# Altium schematic sheet MB_main.SchDoc
size A1; PageSetup: Record=PageOptions|CenterHorizontal=True|CenterVertical=True|PrintScale=1.00|XCorrection=1.00|YCorrection=1.00|PrintKind=0|BorderSize=5000000|LeftOffset=0|BottomOffset=0|Orientation=2|PaperLength=1000|PaperWidth=1000|Scale=100|PaperSource=7|PrintQuality=-4|MediaType=1|DitherType=10|PaperKind=Custom Size|PrintScaleMode=0
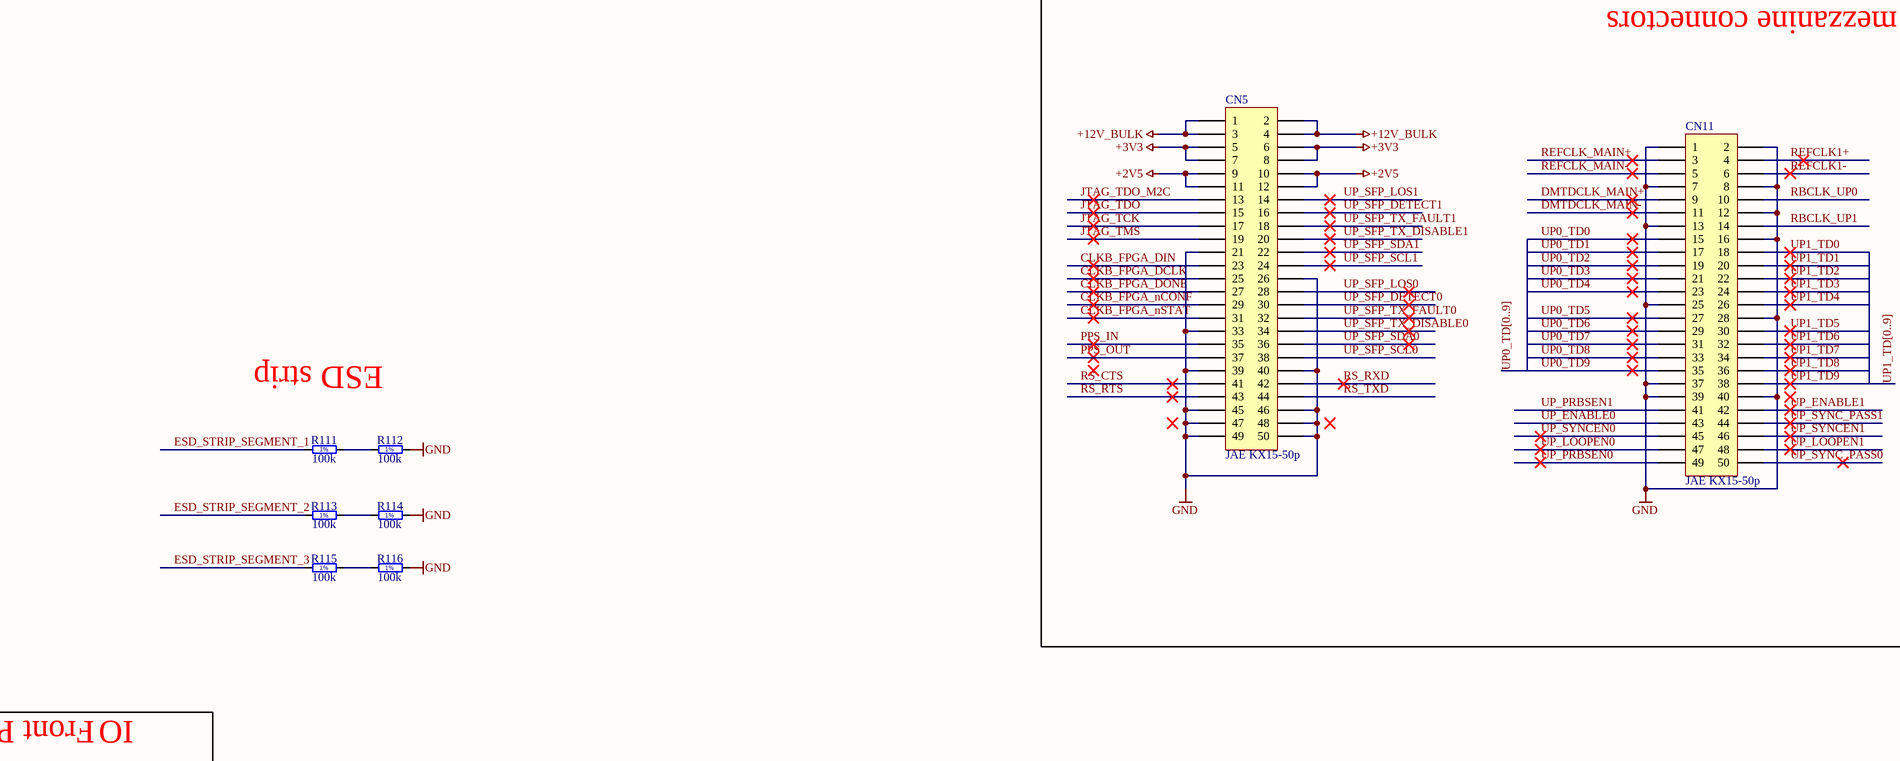
[diagram p0: MB_main.SchDoc, top left]
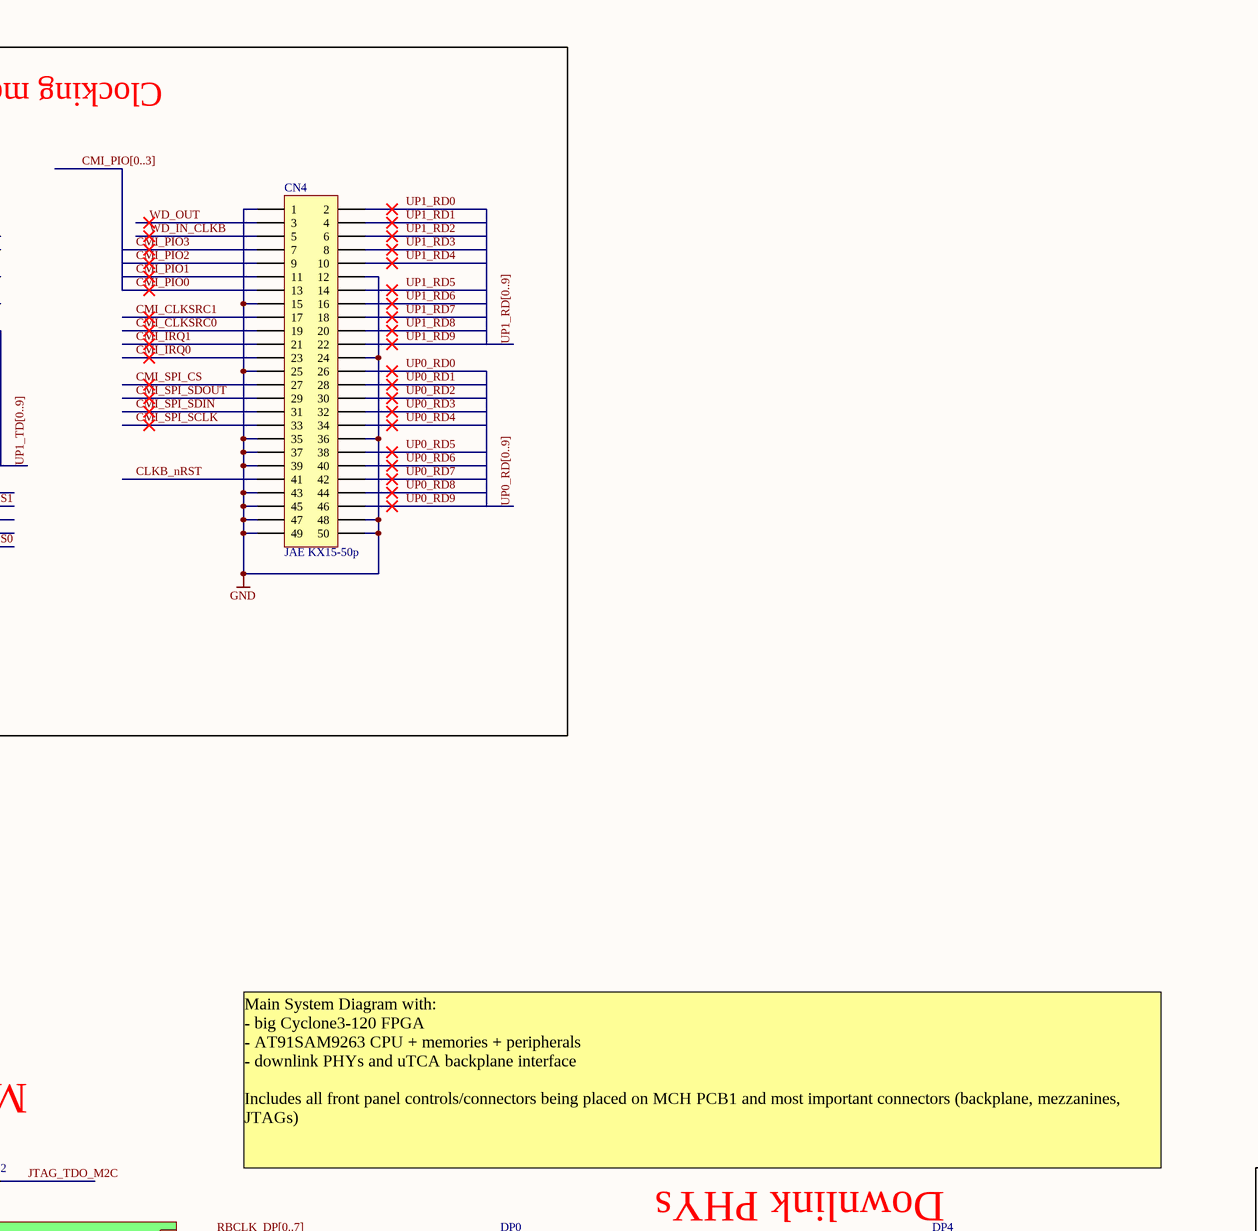
[diagram p1: MB_main.SchDoc, top right]
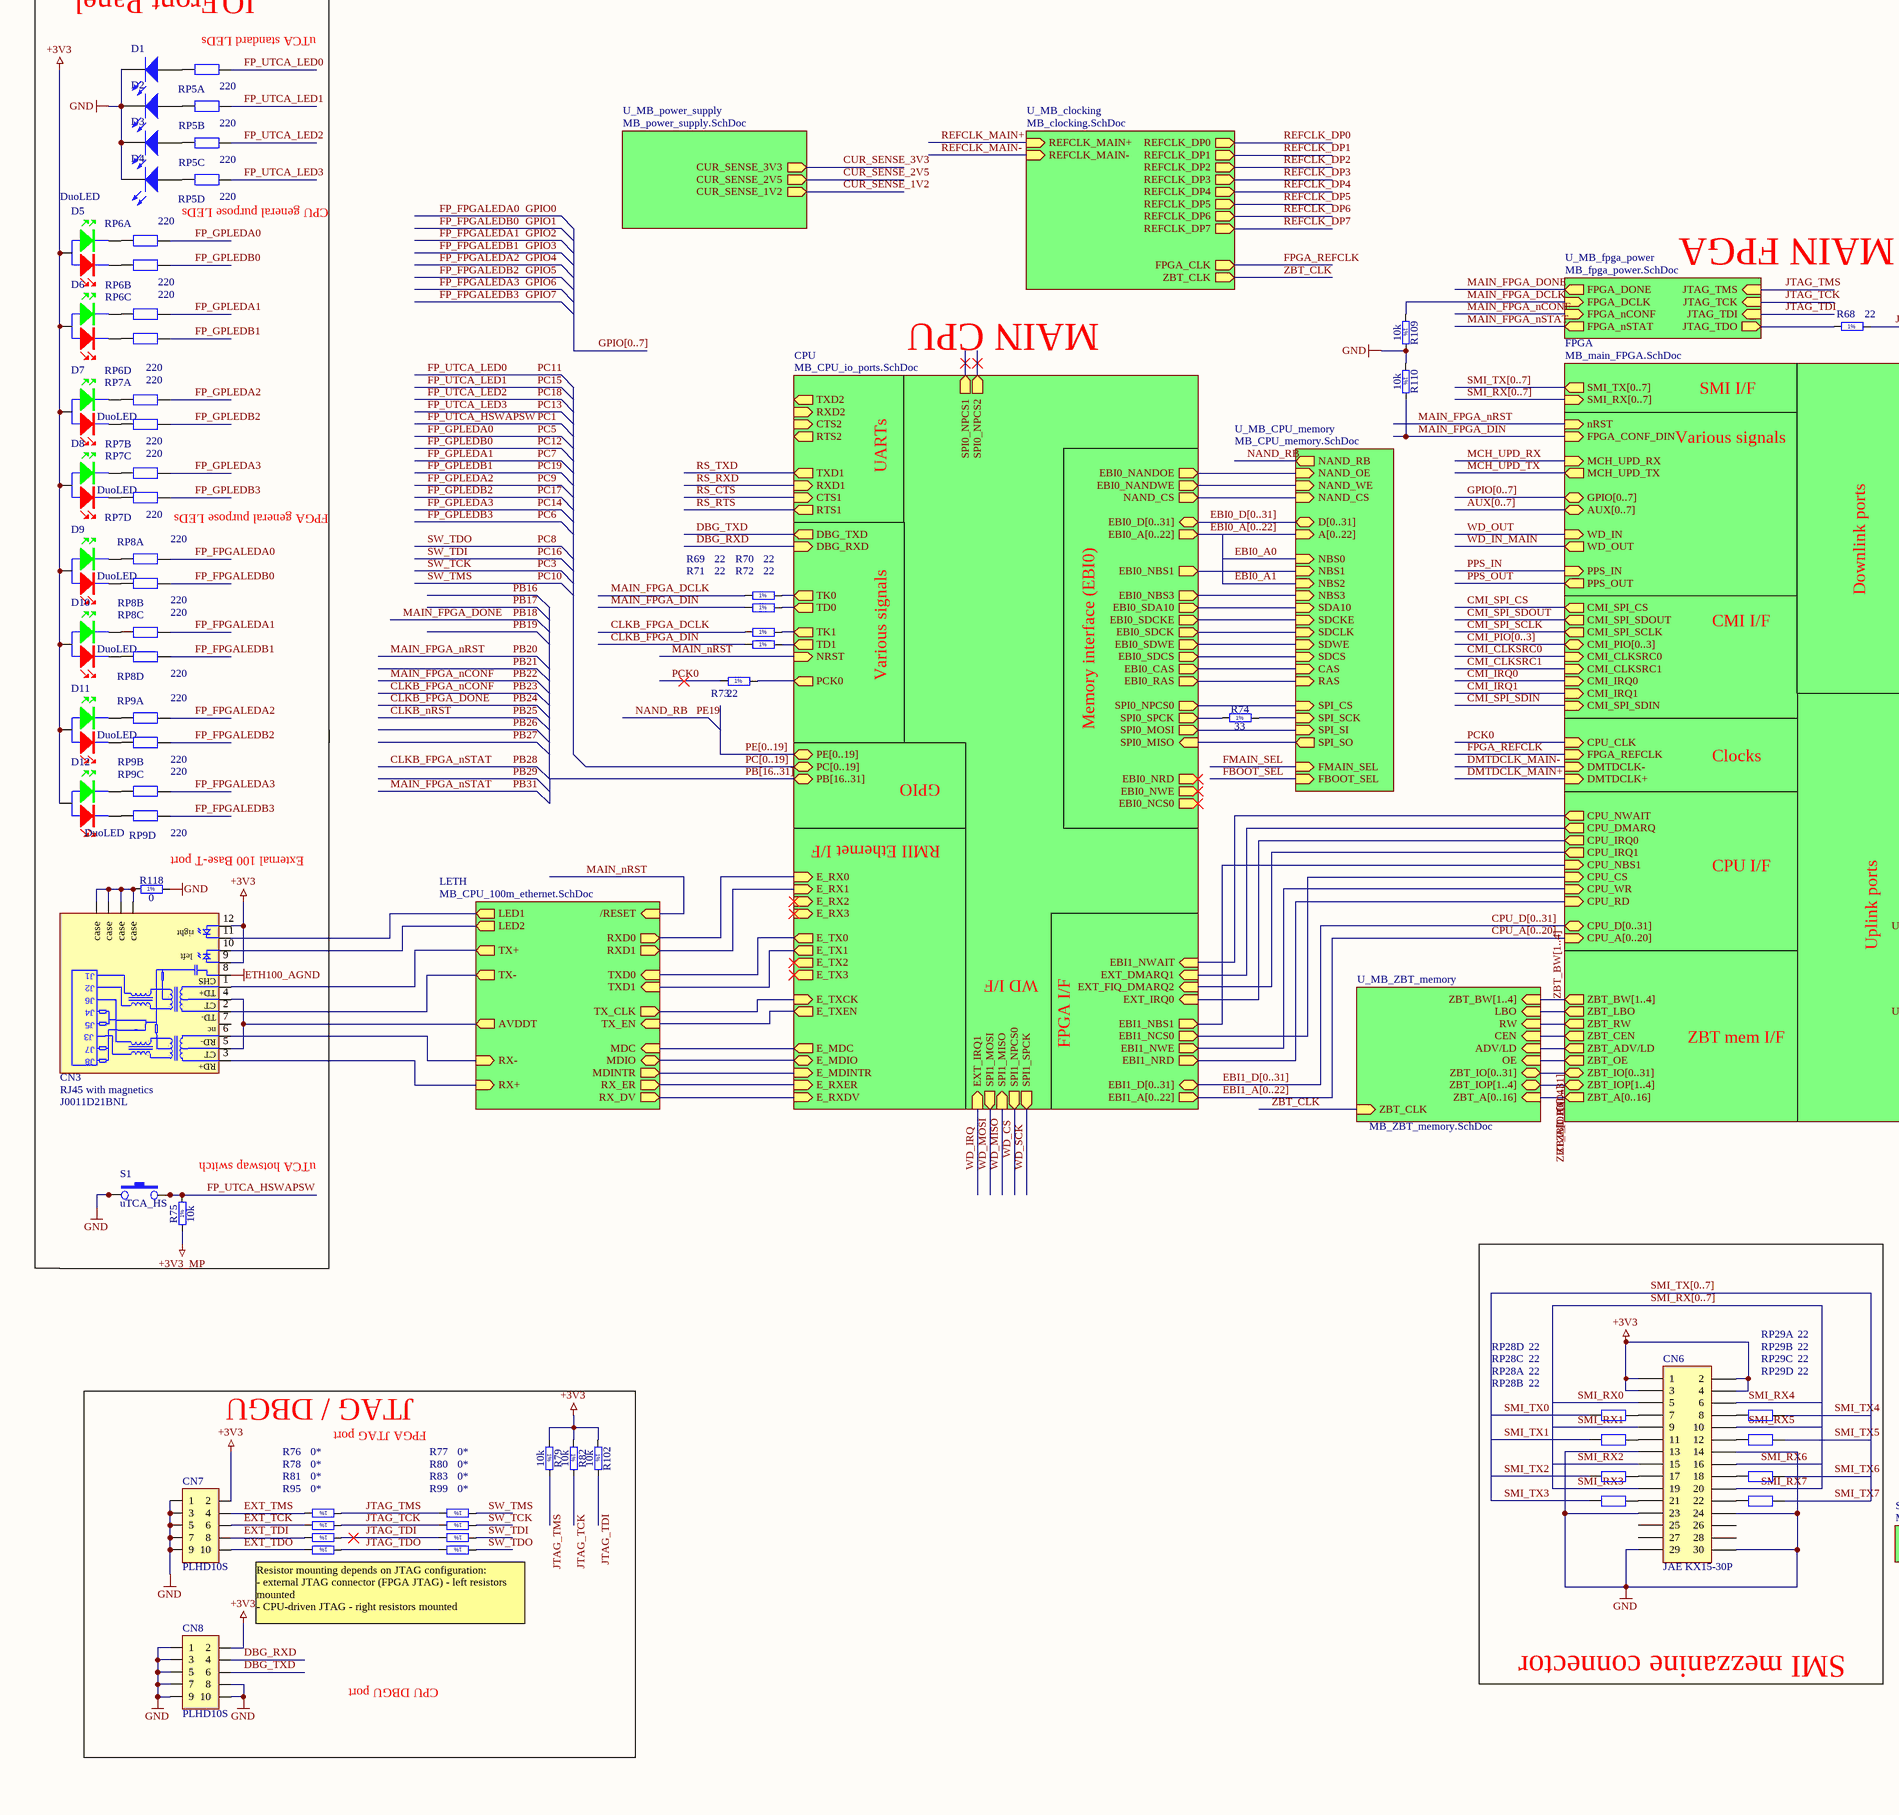
[diagram p2: MB_main.SchDoc, bottom left]
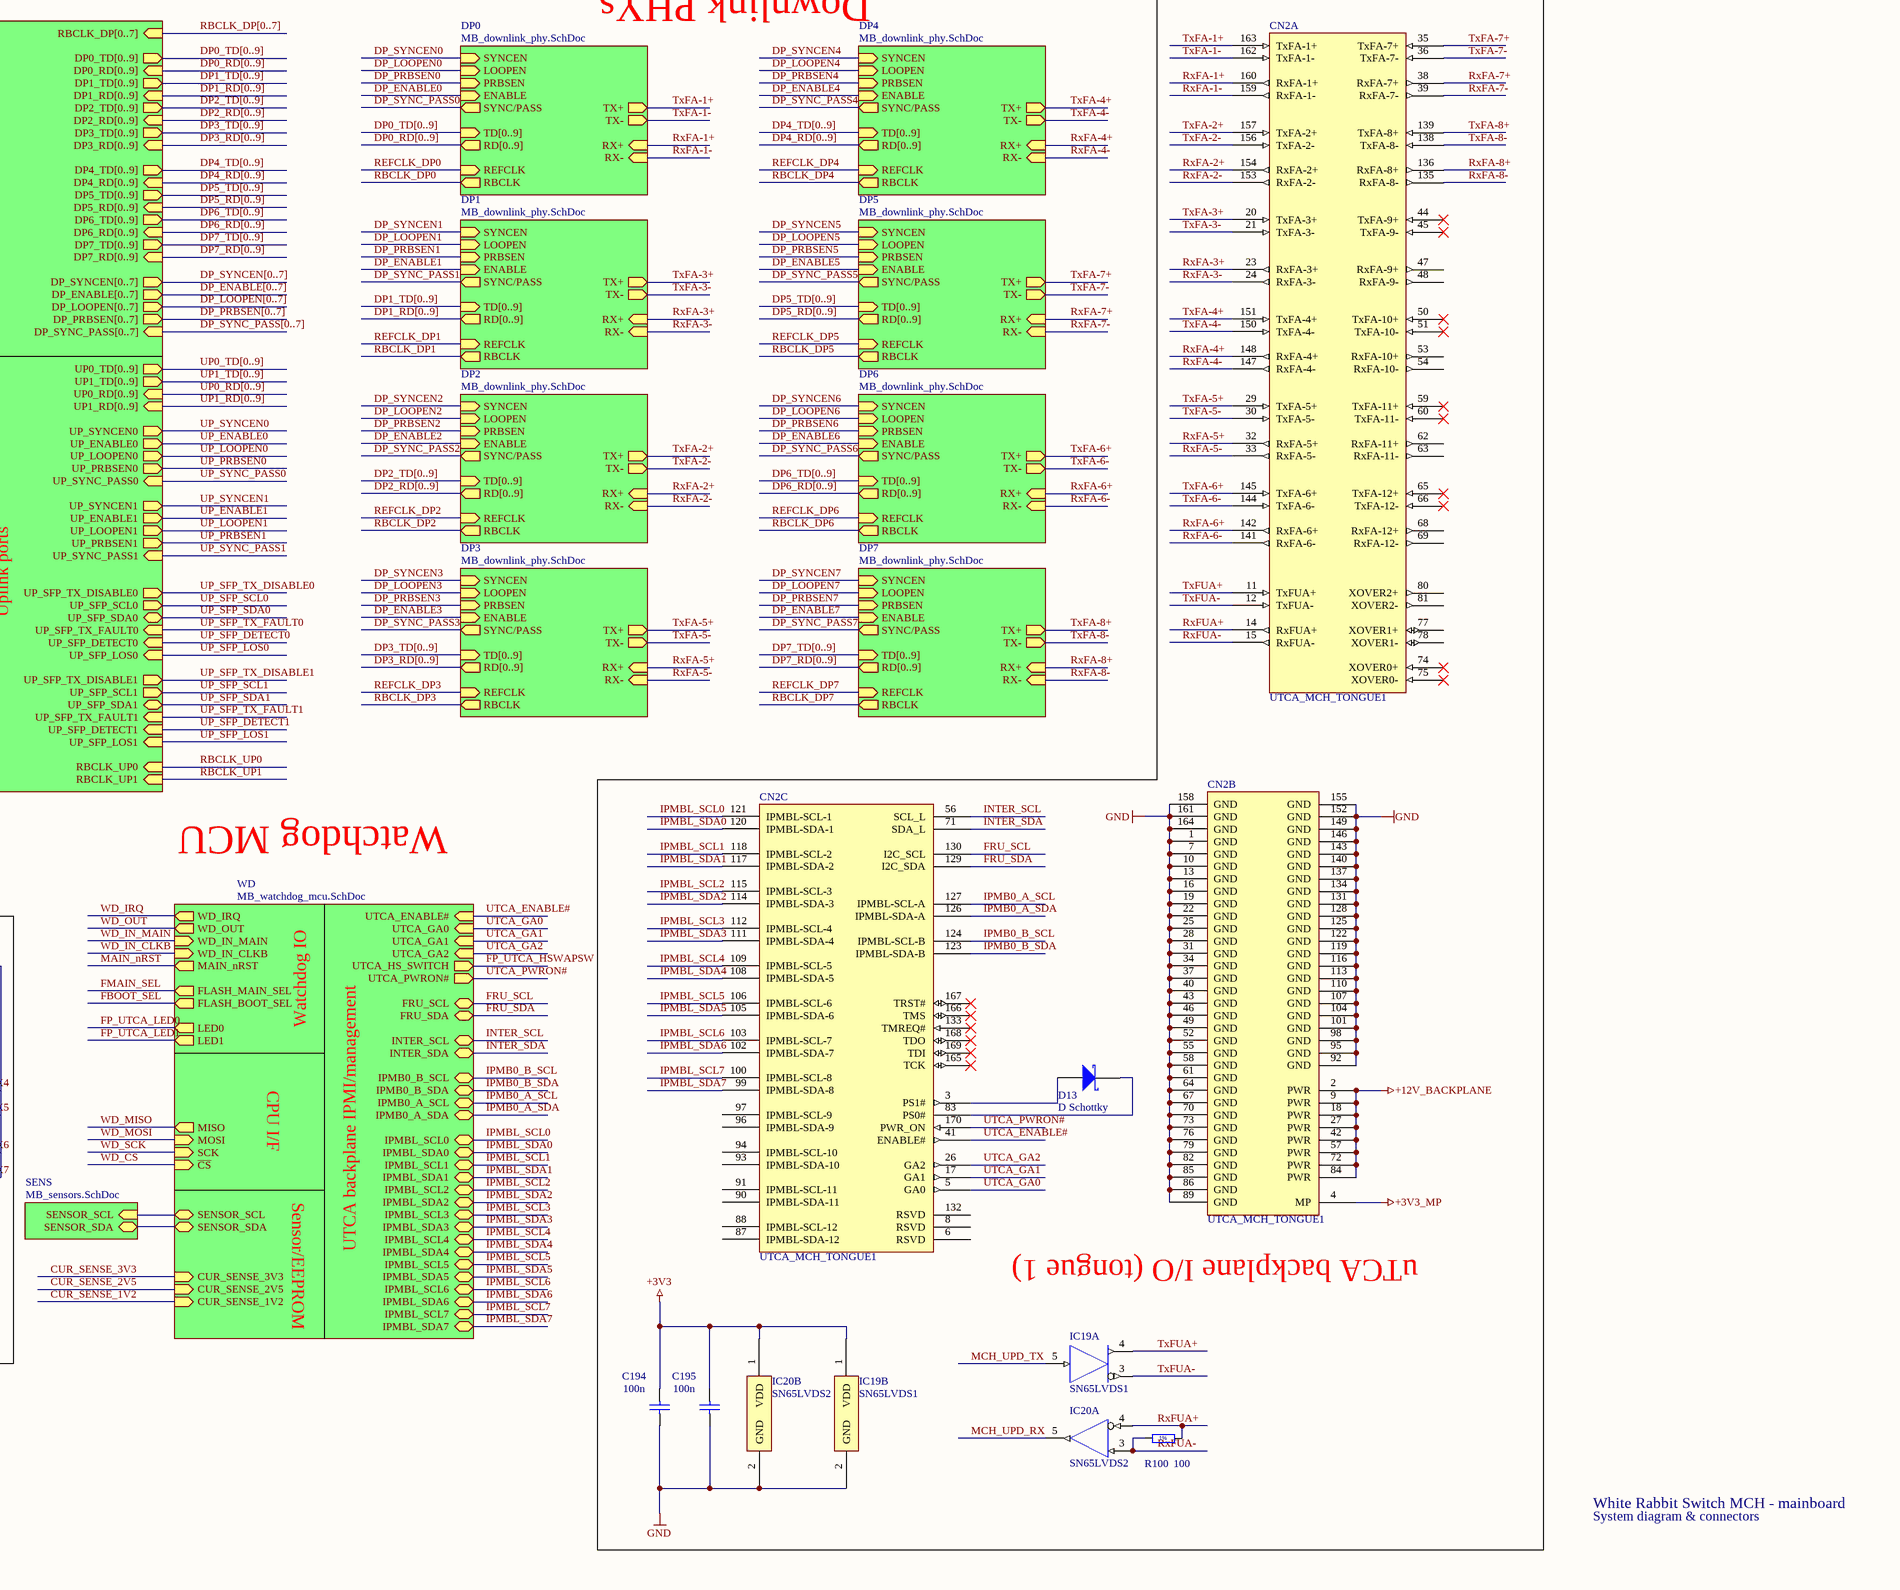
[diagram p3: MB_main.SchDoc, bottom right]

## Parts
C194  100n  [CAPC1005X55N]
C195  100n  [CAPC1005X55N]
CN2  UTCA_MCH_TONGUE1  (parts A,B,C of 3)
CN3  RJ45 with magnetics  value J0011D21BNL  [J0011D21BNL]
CN4  JAE KX15-50p  [JAE_KX15_50P]
CN5  JAE KX15-50p  [JAE_KX15_50P]
CN6  JAE KX15-30P  [JAE_KX15_30P]
CN7  PLHD10S  [PLHTD10S-GC]
CN8  PLHD10S  [PLHTD10S-GC]
CN11  JAE KX15-50p  [JAE_KX15_50P]
D1  LED  [CD1608-0603]  (value not drawn)
D2  LED  [CD1608-0603]  (value not drawn)
D3  LED  [CD1608-0603]  (value not drawn)
D4  LED  [CD1608-0603]  (value not drawn)
D5  DuoLED  [DUOLED_LNJ123]  (value not drawn)
D6  DuoLED  [DUOLED_LNJ123]
D7  DuoLED  [DUOLED_LNJ123]
D8  DuoLED  [DUOLED_LNJ123]
D9  DuoLED  [DUOLED_LNJ123]
D10  DuoLED  [DUOLED_LNJ123]
D11  DuoLED  [DUOLED_LNJ123]
D12  DuoLED  [DUOLED_LNJ123]
D13  D Schottky  [CD2012-0805]
IC19  SN65LVDS1  [SOT23-5AL]  (parts A,B of 2)
IC20  SN65LVDS2  [SOT23-5AL]  (parts A,B of 2)
R68  22  [RESC1005X40N]
R69  22  [RESC1005X40N]
R70  22  [RESC1005X40N]
R71  22  [RESC1005X40N]
R72  22  [RESC1005X40N]
R73  22  [RESC1005X40N]
R74  33  [RESC1005X40N]
R75  10k  [RESC1005X40N]
R76  0*  [RESC1005X40N]
R77  0*  [RESC1005X40N]
R78  0*  [RESC1005X40N]
R79  10k  [RESC1005X40N]
R80  0*  [RESC1005X40N]
R81  0*  [RESC1005X40N]
R82  10k  [RESC1005X40N]
R83  0*  [RESC1005X40N]
R95  0*  [RESC1005X40N]
R99  0*  [RESC1005X40N]
R100  100  [RESC1005X40N]
R102  10k  [RESC1005X40N]
R109  10k  [RESC1005X40N]
R110  10k  [RESC1005X40N]
R111  100k  [RESC3216X65N]
R112  100k  [RESC3216X65N]
R113  100k  [RESC3216X65N]
R114  100k  [RESC3216X65N]
R115  100k  [RESC3216X65N]
R116  100k  [RESC3216X65N]
R118  0  [RESC3216X65N]
RP5  value 220  [YC124]  (hidden comment: RES_PACK)  (parts A,B,C,D of 4)
RP6  value 220  [YC124]  (hidden comment: RES_PACK)  (parts A,B,C,D of 4)
RP7  value 220  [YC124]  (hidden comment: RES_PACK)  (parts A,B,C,D of 4)
RP8  value 220  [YC124]  (hidden comment: RES_PACK)  (parts A,B,C,D of 4)
RP9  value 220  [YC124]  (hidden comment: RES_PACK)  (parts A,B,C,D of 4)
RP28  value 22  [YC124]  (hidden comment: RES_PACK)  (parts A,B,C,D of 4)
RP29  value 22  [YC124]  (hidden comment: RES_PACK)  (parts A,B,C,D of 4)
S1  uTCA_HS  [uTCA_HOTSWAP_SWITCH]

## Blocks framed on the sheet
Clocking mezzanine connectors: CN4 CN5 CN11
uTCA backplane I/O (tongue 1): C194 C195 CN2 D13 IC19 IC20 R100
SMI mezzanine connector: CN6 RP28 RP29
JTAG / DBGU: CN7 CN8 R76-R83 R95 R99 R102

## Sub-sheets
CPU = MB_CPU_io_ports.SchDoc: EXT_IRQ0 (in), EXT_IRQ1 (in), EXT_DMARQ1 (in), EXT_FIQ_DMARQ2 (in), TXD1 (out), RXD1 (in), TXD2 (out), RXD2 (in), RTS2 (out), CTS2 (in), RTS1 (out), CTS1 (in), DBG_TXD (out), DBG_RXD (in), E_TX2 (out), E_TX3 (out), E_RX2 (in), E_RX3 (in), EBI1_NWAIT (in), E_RXER (in), E_TXEN (out), E_MDC (out), E_MDIO (bidir), E_MDINTR (in), E_RXDV (in), EBI0_NWE (out), EBI0_NRD (out), EBI0_NBS1 (out), EBI0_NBS3 (out), EBI0_SDCS (out), EBI0_SDCK (out), EBI0_SDCKE (out), EBI0_SDA10 (out), EBI0_SDWE (out), EBI0_CAS (out), EBI0_RAS (out), EBI1_NCS0 (out), EBI1_NRD (out), EBI1_NWE (out), EBI1_NBS1 (out), PB[16..31] (bidir), PE[0..19] (bidir), PC[0..19] (bidir), EBI0_D[0..31] (bidir), EBI1_D[0..31] (bidir), EBI0_A[0..22] (out), EBI1_A[0..22] (out), NAND_CS (out), EBI0_NCS0 (out), EBI0_NANDOE (out), EBI0_NANDWE (out), E_TX0 (out), E_TX1 (out), E_RX0 (in), E_RX1 (in), SPI0_SPCK (out), SPI0_NPCS1 (out), SPI0_NPCS2 (out), SPI0_NPCS0 (out), SPI1_SPCK (out), SPI1_NPCS0 (out), TK0 (out), TD0 (out), TK1 (out), TD1 (out), SPI0_MISO (in), SPI0_MOSI (out), SPI1_MISO (in), SPI1_MOSI (out), PCK0 (out), E_TXCK (in), NRST (in)
DP0 = MB_downlink_phy.SchDoc: SYNCEN (in), LOOPEN (in), PRBSEN (in), ENABLE (in), SYNC/PASS (out), TD[0..9] (in), RD[0..9] (out), RBCLK (out), REFCLK (in), TX+ (out), TX- (out), RX+ (in), RX- (in)
DP1 = MB_downlink_phy.SchDoc: SYNCEN (in), LOOPEN (in), PRBSEN (in), ENABLE (in), SYNC/PASS (out), TD[0..9] (in), RD[0..9] (out), RBCLK (out), REFCLK (in), TX+ (out), TX- (out), RX+ (in), RX- (in)
DP2 = MB_downlink_phy.SchDoc: SYNCEN (in), LOOPEN (in), PRBSEN (in), ENABLE (in), SYNC/PASS (out), TD[0..9] (in), RD[0..9] (out), RBCLK (out), REFCLK (in), TX+ (out), TX- (out), RX+ (in), RX- (in)
DP3 = MB_downlink_phy.SchDoc: SYNCEN (in), LOOPEN (in), PRBSEN (in), ENABLE (in), SYNC/PASS (out), TD[0..9] (in), RD[0..9] (out), RBCLK (out), REFCLK (in), TX+ (out), TX- (out), RX+ (in), RX- (in)
DP4 = MB_downlink_phy.SchDoc: SYNCEN (in), LOOPEN (in), PRBSEN (in), ENABLE (in), SYNC/PASS (out), TD[0..9] (in), RD[0..9] (out), RBCLK (out), REFCLK (in), TX+ (out), TX- (out), RX+ (in), RX- (in)
DP5 = MB_downlink_phy.SchDoc: SYNCEN (in), LOOPEN (in), PRBSEN (in), ENABLE (in), SYNC/PASS (out), TD[0..9] (in), RD[0..9] (out), RBCLK (out), REFCLK (in), TX+ (out), TX- (out), RX+ (in), RX- (in)
DP6 = MB_downlink_phy.SchDoc: SYNCEN (in), LOOPEN (in), PRBSEN (in), ENABLE (in), SYNC/PASS (out), TD[0..9] (in), RD[0..9] (out), RBCLK (out), REFCLK (in), TX+ (out), TX- (out), RX+ (in), RX- (in)
DP7 = MB_downlink_phy.SchDoc: SYNCEN (in), LOOPEN (in), PRBSEN (in), ENABLE (in), SYNC/PASS (out), TD[0..9] (in), RD[0..9] (out), RBCLK (out), REFCLK (in), TX+ (out), TX- (out), RX+ (in), RX- (in)
FPGA = MB_main_FPGA.SchDoc: FPGA_CONF_DIN (in), DP0_TD[0..9] (out), DP0_RD[0..9] (in), DP1_TD[0..9] (out), DP1_RD[0..9] (in), DP2_TD[0..9] (out), DP2_RD[0..9] (in), DP3_TD[0..9] (out), DP3_RD[0..9] (in), DP4_TD[0..9] (out), DP4_RD[0..9] (in), DP5_TD[0..9] (out), DP5_RD[0..9] (in), DP6_TD[0..9] (out), DP6_RD[0..9] (in), DP7_TD[0..9] (out), DP7_RD[0..9] (in), UP0_TD[0..9] (out), UP0_RD[0..9] (in), UP1_TD[0..9] (out), UP1_RD[0..9] (in), DP_PRBSEN[0..7] (out), DP_SYNCEN[0..7] (out), DP_ENABLE[0..7] (out), DP_LOOPEN[0..7] (out), DP_SYNC_PASS[0..7] (in), UP_PRBSEN0 (out), UP_LOOPEN0 (out), UP_SYNCEN0 (out), UP_ENABLE0 (out), UP_SYNC_PASS0 (in), UP_PRBSEN1 (out), UP_LOOPEN1 (out), UP_SYNCEN1 (out), UP_ENABLE1 (out), UP_SYNC_PASS1 (in), UP_SFP_TX_FAULT0 (in), UP_SFP_TX_DISABLE0 (out), UP_SFP_SDA0 (bidir), UP_SFP_SCL0 (out), UP_SFP_DETECT0 (in), UP_SFP_LOS0 (in), UP_SFP_TX_FAULT1 (in), UP_SFP_TX_DISABLE1 (out), UP_SFP_SDA1 (bidir), UP_SFP_SCL1 (out), UP_SFP_DETECT1 (in), UP_SFP_LOS1 (in), ZBT_LBO (out), ZBT_RW (out), ZBT_CEN (out), ZBT_ADV/LD (out), ZBT_OE (out), ZBT_IO[0..31] (bidir), ZBT_IOP[1..4] (bidir), ZBT_A[0..16] (out), ZBT_BW[1..4] (out), GPIO[0..7] (bidir), DMTDCLK+ (in), DMTDCLK- (in), FPGA_REFCLK (in), WD_IN (in), WD_OUT (out), PPS_IN (in), PPS_OUT (out), MCH_UPD_TX (out), MCH_UPD_RX (in), SMI_TX[0..7] (out), SMI_RX[0..7] (in), CPU_D[0..31] (bidir), CPU_CLK (in), AUX[0..7] (bidir), CMI_PIO[0..3] (bidir), CPU_WR (in), CPU_RD (in), CPU_CS (in), CPU_NWAIT (out), CPU_DMARQ (out), CPU_IRQ0 (out), CPU_IRQ1 (out), CMI_CLKSRC0 (in), CMI_CLKSRC1 (in), CMI_IRQ0 (in), CMI_IRQ1 (in), CMI_SPI_CS (out), CMI_SPI_SDOUT (out), CMI_SPI_SDIN (in), CMI_SPI_SCLK (out), RBCLK_DP[0..7] (in), RBCLK_UP0 (in), RBCLK_UP1 (in), nRST (in), CPU_A[0..20] (in), CPU_NBS1 (in)
LETH = MB_CPU_100m_ethernet.SchDoc: TXD0 (in), TXD1 (in), TX_EN (in), RXD1 (out), RXD0 (out), RX_DV (out), RX_ER (out), MDC (in), MDIO (bidir), MDINTR (out), RX+ (in), RX- (in), LED1 (out), LED2 (out), TX+ (out), TX- (out), AVDDT (out), TX_CLK (out), /RESET (in)
SENS = MB_sensors.SchDoc: SENSOR_SDA (bidir), SENSOR_SCL (in)
U_MB_clocking = MB_clocking.SchDoc: REFCLK_MAIN+ (in), REFCLK_MAIN- (in), REFCLK_DP0 (out), REFCLK_DP1 (out), REFCLK_DP2 (out), REFCLK_DP3 (out), REFCLK_DP4 (out), REFCLK_DP5 (out), REFCLK_DP6 (out), REFCLK_DP7 (out), FPGA_CLK (out), ZBT_CLK (out)
U_MB_CPU_memory = MB_CPU_memory.SchDoc: NBS0 (in), NBS1 (in), NBS2 (in), NBS3 (in), A[0..22] (in), CAS (in), RAS (in), NAND_OE (in), NAND_WE (in), NAND_CS (in), NAND_RB (out), FMAIN_SEL (in), FBOOT_SEL (in), SPI_CS (in), SPI_SCK (in), SPI_SI (in), SPI_SO (out), SDA10 (in), D[0..31] (bidir), SDCS (in), SDCKE (in), SDCLK (in), SDWE (in)
U_MB_fpga_power = MB_fpga_power.SchDoc: JTAG_TDI (in), JTAG_TDO (out), JTAG_TMS (in), JTAG_TCK (in), FPGA_DCLK (in), FPGA_DONE (out), FPGA_nCONF (in), FPGA_nSTAT (out)
U_MB_power_supply = MB_power_supply.SchDoc: CUR_SENSE_3V3 (out), CUR_SENSE_2V5 (out), CUR_SENSE_1V2 (out)
U_MB_ZBT_memory = MB_ZBT_memory.SchDoc: LBO (in), RW (in), CEN (in), ADV/LD (in), OE (in), ZBT_IOP[1..4] (bidir), ZBT_IO[0..31] (bidir), ZBT_A[0..16] (in), ZBT_BW[1..4] (in), ZBT_CLK (in)
WD = MB_watchdog_mcu.SchDoc: MAIN_nRST (out), UTCA_GA0 (in), UTCA_GA1 (in), UTCA_GA2 (in), UTCA_ENABLE# (in), WD_IN_MAIN (in), WD_IN_CLKB (in), WD_OUT (out), FLASH_MAIN_SEL (out), FLASH_BOOT_SEL (out), UTCA_PWRON# (out), WD_IRQ (out), IPMB0_A_SDA (bidir), IPMB0_A_SCL (bidir), IPMB0_B_SCL (bidir), IPMB0_B_SDA (bidir), FRU_SCL (bidir), FRU_SDA (bidir), INTER_SCL (bidir), INTER_SDA (bidir), SENSOR_SCL (bidir), SENSOR_SDA (bidir), MOSI (in), SCK (in), MISO (out), ~{CS} (in), IPMBL_SCL0 (bidir), IPMBL_SCL1 (bidir), IPMBL_SCL2 (bidir), IPMBL_SCL3 (bidir), IPMBL_SCL4 (bidir), IPMBL_SCL5 (bidir), IPMBL_SCL6 (bidir), IPMBL_SCL7 (bidir), IPMBL_SDA0 (bidir), IPMBL_SDA1 (bidir), IPMBL_SDA2 (bidir), IPMBL_SDA3 (bidir), IPMBL_SDA4 (bidir), IPMBL_SDA5 (bidir), IPMBL_SDA6 (bidir), IPMBL_SDA7 (bidir), UTCA_HS_SWITCH (out), CUR_SENSE_1V2 (in), CUR_SENSE_2V5 (in), CUR_SENSE_3V3 (in), LED0 (out), LED1 (out)

## Nets
+2V5: CN5.9 CN5.10 CN5.11 CN5.12
+3V3: C194.2 C195.2 CN3.9 CN3.12 CN5.5 CN5.6 CN5.7 CN5.8 CN6.1 CN6.2 CN6.3 CN6.4 CN7.2 CN8.2 D5.A D6.A D7.A D8.A D9.A D10.A D11.A D12.A IC19.1(VDD) IC20.1(VDD) R79.1 R82.1 R102.1
+3V3_MP: CN2.4(MP) R75.1
+12V_BACKPLANE: CN2.2(PWR) CN2.9(PWR) CN2.18(PWR) CN2.27(PWR) CN2.42(PWR) CN2.57(PWR) CN2.72(PWR) CN2.84(PWR)
+12V_BULK: CN5.1 CN5.2 CN5.3 CN5.4
ETH100_AGND: CN3.8
GND: C194.1 C195.1 CN2.1(GND) CN2.7(GND) CN2.10(GND) CN2.13(GND) CN2.16(GND) CN2.19(GND) CN2.22(GND) CN2.25(GND) CN2.28(GND) CN2.31(GND) CN2.34(GND) CN2.37(GND) CN2.40(GND) CN2.43(GND) CN2.46(GND) CN2.49(GND) CN2.52(GND) CN2.55(GND) CN2.58(GND) CN2.61(GND) CN2.64(GND) CN2.67(GND) CN2.70(GND) CN2.73(GND) CN2.76(GND) CN2.79(GND) CN2.82(GND) CN2.85(GND) CN2.86(GND) CN2.89(GND) CN2.92(GND) CN2.95(GND) CN2.98(GND) CN2.101(GND) CN2.104(GND) CN2.107(GND) CN2.110(GND) CN2.113(GND) CN2.116(GND) CN2.119(GND) CN2.122(GND) CN2.125(GND) CN2.128(GND) CN2.131(GND) CN2.134(GND) CN2.137(GND) CN2.140(GND) CN2.143(GND) CN2.146(GND) CN2.149(GND) CN2.152(GND) CN2.155(GND) CN2.158(GND) CN2.161(GND) CN2.164(GND) CN4.1 CN4.12 CN4.15 CN4.24 CN4.25 CN4.35 CN4.36 CN4.37 CN4.39 CN4.43 CN4.45 CN4.47 CN4.48 CN4.49 CN4.50 CN5.21 CN5.26 CN5.33 CN5.39 CN5.40 CN5.45 CN5.46 CN5.47 CN5.48 CN5.49 CN5.50 CN6.13 CN6.14 CN6.23 CN6.24 CN6.29 CN6.30 CN7.1 CN7.3 CN7.5 CN7.7 CN7.9 CN8.1 CN8.3 CN8.5 CN8.7 CN8.8 CN8.9 CN8.10 CN11.1 CN11.2 CN11.7 CN11.8 CN11.12 CN11.13 CN11.16 CN11.25 CN11.28 CN11.37 CN11.39 CN11.40 D1.2(K) D2.2(K) D3.2(K) D4.2(K) IC19.2(GND) IC20.2(GND) R109.2 R110.1 R112.2 R114.2 R116.2 R118.2 S1.A S1.C
CLKB_FPGA_DCLK: CN5.25 R70.1
CLKB_FPGA_DIN: CN5.23 R72.1
CLKB_FPGA_DONE: CN5.27  [also labelled PB24]
CLKB_FPGA_nCONF: CN5.29  [also labelled PB23]
CLKB_FPGA_nSTAT: CN5.31  [also labelled PB28]
CLKB_nRST: CN4.41  [also labelled PB25]
CMI_CLKSRC0: CN4.19 ; sheet FPGA/CMI_CLKSRC0
CMI_CLKSRC1: CN4.17 ; sheet FPGA/CMI_CLKSRC1
CMI_IRQ0: CN4.23 ; sheet FPGA/CMI_IRQ0
CMI_IRQ1: CN4.21 ; sheet FPGA/CMI_IRQ1
CMI_PIO0: CN4.13
CMI_PIO1: CN4.11
CMI_PIO2: CN4.9
CMI_PIO3: CN4.7
CMI_SPI_CS: CN4.27 ; sheet FPGA/CMI_SPI_CS
CMI_SPI_SCLK: CN4.33 ; sheet FPGA/CMI_SPI_SCLK
CMI_SPI_SDIN: CN4.31 ; sheet FPGA/CMI_SPI_SDIN
CMI_SPI_SDOUT: CN4.29 ; sheet FPGA/CMI_SPI_SDOUT
CUR_SENSE_1V2: sheet U_MB_power_supply/CUR_SENSE_1V2, sheet WD/CUR_SENSE_1V2
CUR_SENSE_2V5: sheet U_MB_power_supply/CUR_SENSE_2V5, sheet WD/CUR_SENSE_2V5
CUR_SENSE_3V3: sheet U_MB_power_supply/CUR_SENSE_3V3, sheet WD/CUR_SENSE_3V3
DBG_RXD: CN8.4 ; sheet CPU/DBG_RXD
DBG_TXD: CN8.6 ; sheet CPU/DBG_TXD
DMTDCLK_MAIN+: CN11.9 ; sheet FPGA/DMTDCLK+
DMTDCLK_MAIN-: CN11.11 ; sheet FPGA/DMTDCLK-
DP_ENABLE0: sheet DP0/ENABLE
DP_ENABLE1: sheet DP1/ENABLE
DP_ENABLE2: sheet DP2/ENABLE
DP_ENABLE3: sheet DP3/ENABLE
DP_ENABLE4: sheet DP4/ENABLE
DP_ENABLE5: sheet DP5/ENABLE
DP_ENABLE6: sheet DP6/ENABLE
DP_ENABLE7: sheet DP7/ENABLE
DP_LOOPEN0: sheet DP0/LOOPEN
DP_LOOPEN1: sheet DP1/LOOPEN
DP_LOOPEN2: sheet DP2/LOOPEN
DP_LOOPEN3: sheet DP3/LOOPEN
DP_LOOPEN4: sheet DP4/LOOPEN
DP_LOOPEN5: sheet DP5/LOOPEN
DP_LOOPEN6: sheet DP6/LOOPEN
DP_LOOPEN7: sheet DP7/LOOPEN
DP_PRBSEN0: sheet DP0/PRBSEN
DP_PRBSEN1: sheet DP1/PRBSEN
DP_PRBSEN2: sheet DP2/PRBSEN
DP_PRBSEN3: sheet DP3/PRBSEN
DP_PRBSEN4: sheet DP4/PRBSEN
DP_PRBSEN5: sheet DP5/PRBSEN
DP_PRBSEN6: sheet DP6/PRBSEN
DP_PRBSEN7: sheet DP7/PRBSEN
DP_SYNC_PASS0: sheet DP0/SYNC/PASS
DP_SYNC_PASS1: sheet DP1/SYNC/PASS
DP_SYNC_PASS2: sheet DP2/SYNC/PASS
DP_SYNC_PASS3: sheet DP3/SYNC/PASS
DP_SYNC_PASS4: sheet DP4/SYNC/PASS
DP_SYNC_PASS5: sheet DP5/SYNC/PASS
DP_SYNC_PASS6: sheet DP6/SYNC/PASS
DP_SYNC_PASS7: sheet DP7/SYNC/PASS
DP_SYNCEN0: sheet DP0/SYNCEN
DP_SYNCEN1: sheet DP1/SYNCEN
DP_SYNCEN2: sheet DP2/SYNCEN
DP_SYNCEN3: sheet DP3/SYNCEN
DP_SYNCEN4: sheet DP4/SYNCEN
DP_SYNCEN5: sheet DP5/SYNCEN
DP_SYNCEN6: sheet DP6/SYNCEN
DP_SYNCEN7: sheet DP7/SYNCEN
EBI0_A0: sheet U_MB_CPU_memory/NBS0
EBI0_A1: sheet U_MB_CPU_memory/NBS2
ESD_STRIP_SEGMENT_1: R111.1
ESD_STRIP_SEGMENT_2: R113.1
ESD_STRIP_SEGMENT_3: R115.1
EXT_TCK: CN7.6 R81.2
EXT_TDI: CN7.8 R95.2
EXT_TDO: CN7.10 R76.2
EXT_TMS: CN7.4 R78.2
FBOOT_SEL: sheet U_MB_CPU_memory/FBOOT_SEL, sheet WD/FLASH_BOOT_SEL
FMAIN_SEL: sheet U_MB_CPU_memory/FMAIN_SEL, sheet WD/FLASH_MAIN_SEL
FP_FPGALEDA0: RP8.8(B)  [also labelled GPIO0]
FP_FPGALEDA1: RP8.6(B)  [also labelled GPIO2]
FP_FPGALEDA2: RP9.8(B)  [also labelled GPIO4]
FP_FPGALEDA3: RP9.6(B)  [also labelled GPIO6]
FP_FPGALEDB0: RP8.7(B)  [also labelled GPIO1]
FP_FPGALEDB1: RP8.5(B)  [also labelled GPIO3]
FP_FPGALEDB2: RP9.7(B)  [also labelled GPIO5]
FP_FPGALEDB3: RP9.5(B)  [also labelled GPIO7]
FP_GPLEDA0: RP6.8(B)  [also labelled PC5]
FP_GPLEDA1: RP6.6(B)  [also labelled PC7]
FP_GPLEDA2: RP7.8(B)  [also labelled PC9]
FP_GPLEDA3: RP7.6(B)  [also labelled PC14]
FP_GPLEDB0: RP6.7(B)  [also labelled PC12]
FP_GPLEDB1: RP6.5(B)  [also labelled PC19]
FP_GPLEDB2: RP7.7(B)  [also labelled PC17]
FP_GPLEDB3: RP7.5(B)  [also labelled PC6]
FP_UTCA_HSWAPSW: R75.2 S1.B S1.D ; sheet WD/UTCA_HS_SWITCH  [also labelled PC1]
FP_UTCA_LED0: RP5.8(B) ; sheet WD/LED0  [also labelled PC11]
FP_UTCA_LED1: RP5.7(B) ; sheet WD/LED1  [also labelled PC15]
FP_UTCA_LED2: RP5.6(B)  [also labelled PC18]
FP_UTCA_LED3: RP5.5(B)  [also labelled PC13]
FPGA_REFCLK: sheet FPGA/FPGA_REFCLK, sheet U_MB_clocking/FPGA_CLK
FRU_SCL: CN2.130(I2C_SCL) ; sheet WD/FRU_SCL
FRU_SDA: CN2.129(I2C_SDA) ; sheet WD/FRU_SDA
INTER_SCL: CN2.56(SCL_L) ; sheet WD/INTER_SCL
INTER_SDA: CN2.71(SDA_L) ; sheet WD/INTER_SDA
IPMB0_A_SCL: CN2.127(IPMBL-SCL-A) ; sheet WD/IPMB0_A_SCL
IPMB0_A_SDA: CN2.126(IPMBL-SDA-A) ; sheet WD/IPMB0_A_SDA
IPMB0_B_SCL: CN2.124(IPMBL-SCL-B) ; sheet WD/IPMB0_B_SCL
IPMB0_B_SDA: CN2.123(IPMBL-SDA-B) ; sheet WD/IPMB0_B_SDA
IPMBL_SCL0: CN2.121(IPMBL-SCL-1) ; sheet WD/IPMBL_SCL0
IPMBL_SCL1: CN2.118(IPMBL-SCL-2) ; sheet WD/IPMBL_SCL1
IPMBL_SCL2: CN2.115(IPMBL-SCL-3) ; sheet WD/IPMBL_SCL2
IPMBL_SCL3: CN2.112(IPMBL-SCL-4) ; sheet WD/IPMBL_SCL3
IPMBL_SCL4: CN2.109(IPMBL-SCL-5) ; sheet WD/IPMBL_SCL4
IPMBL_SCL5: CN2.106(IPMBL-SCL-6) ; sheet WD/IPMBL_SCL5
IPMBL_SCL6: CN2.103(IPMBL-SCL-7) ; sheet WD/IPMBL_SCL6
IPMBL_SCL7: CN2.100(IPMBL-SCL-8) ; sheet WD/IPMBL_SCL7
IPMBL_SDA0: CN2.120(IPMBL-SDA-1) ; sheet WD/IPMBL_SDA0
IPMBL_SDA1: CN2.117(IPMBL-SDA-2) ; sheet WD/IPMBL_SDA1
IPMBL_SDA2: CN2.114(IPMBL-SDA-3) ; sheet WD/IPMBL_SDA2
IPMBL_SDA3: CN2.111(IPMBL-SDA-4) ; sheet WD/IPMBL_SDA3
IPMBL_SDA4: CN2.108(IPMBL-SDA-5) ; sheet WD/IPMBL_SDA4
IPMBL_SDA5: CN2.105(IPMBL-SDA-6) ; sheet WD/IPMBL_SDA5
IPMBL_SDA6: CN2.102(IPMBL-SDA-7) ; sheet WD/IPMBL_SDA6
IPMBL_SDA7: CN2.99(IPMBL-SDA-8) ; sheet WD/IPMBL_SDA7
JTAG_TCK: CN5.17 R81.1 R82.2 R83.2 ; sheet U_MB_fpga_power/JTAG_TCK
JTAG_TDI: R80.2 R95.1 R102.2 ; sheet U_MB_fpga_power/JTAG_TDI
JTAG_TDO: CN5.15 R76.1 R99.2
JTAG_TDO_M2C: CN5.13 R68.2
JTAG_TMS: CN5.19 R77.2 R78.1 R79.2 ; sheet U_MB_fpga_power/JTAG_TMS
MAIN_FPGA_DCLK: R69.1 R109.1 ; sheet U_MB_fpga_power/FPGA_DCLK
MAIN_FPGA_DIN: R71.1 R110.2 ; sheet FPGA/FPGA_CONF_DIN
MAIN_FPGA_DONE: sheet U_MB_fpga_power/FPGA_DONE  [also labelled PB18]
MAIN_FPGA_nCONF: sheet U_MB_fpga_power/FPGA_nCONF  [also labelled PB22]
MAIN_FPGA_nRST: sheet FPGA/nRST  [also labelled PB20]
MAIN_FPGA_nSTAT: sheet U_MB_fpga_power/FPGA_nSTAT  [also labelled PB31]
MAIN_nRST: sheet LETH//RESET, sheet CPU/NRST, sheet WD/MAIN_nRST
MCH_UPD_RX: IC20.5(Q) ; sheet FPGA/MCH_UPD_RX
MCH_UPD_TX: IC19.5(A) ; sheet FPGA/MCH_UPD_TX
NAND_RB: sheet U_MB_CPU_memory/NAND_RB  [also labelled PE19]
PC3: R83.1  [also labelled SW_TCK]
PC8: R99.1  [also labelled SW_TDO]
PC10: R77.1  [also labelled SW_TMS]
PC16: R80.1  [also labelled SW_TDI]
PCK0: R73.1 ; sheet FPGA/CPU_CLK
PPS_IN: CN5.35 ; sheet FPGA/PPS_IN
PPS_OUT: CN5.37 ; sheet FPGA/PPS_OUT
RBCLK_DP0: sheet DP0/RBCLK
RBCLK_DP1: sheet DP1/RBCLK
RBCLK_DP2: sheet DP2/RBCLK
RBCLK_DP3: sheet DP3/RBCLK
RBCLK_DP4: sheet DP4/RBCLK
RBCLK_DP5: sheet DP5/RBCLK
RBCLK_DP6: sheet DP6/RBCLK
RBCLK_DP7: sheet DP7/RBCLK
RBCLK_UP0: CN11.10 ; sheet FPGA/RBCLK_UP0
RBCLK_UP1: CN11.14 ; sheet FPGA/RBCLK_UP1
REFCLK1+: CN11.4
REFCLK1-: CN11.6
REFCLK_DP0: sheet U_MB_clocking/REFCLK_DP0, sheet DP0/REFCLK
REFCLK_DP1: sheet U_MB_clocking/REFCLK_DP1, sheet DP1/REFCLK
REFCLK_DP2: sheet U_MB_clocking/REFCLK_DP2, sheet DP2/REFCLK
REFCLK_DP3: sheet U_MB_clocking/REFCLK_DP3, sheet DP3/REFCLK
REFCLK_DP4: sheet U_MB_clocking/REFCLK_DP4, sheet DP4/REFCLK
REFCLK_DP5: sheet U_MB_clocking/REFCLK_DP5, sheet DP5/REFCLK
REFCLK_DP6: sheet U_MB_clocking/REFCLK_DP6, sheet DP6/REFCLK
REFCLK_DP7: sheet U_MB_clocking/REFCLK_DP7, sheet DP7/REFCLK
REFCLK_MAIN+: CN11.3 ; sheet U_MB_clocking/REFCLK_MAIN+
REFCLK_MAIN-: CN11.5 ; sheet U_MB_clocking/REFCLK_MAIN-
RS_CTS: CN5.41 ; sheet CPU/CTS1
RS_RTS: CN5.43 ; sheet CPU/RTS1
RS_RXD: CN5.42 ; sheet CPU/RXD1
RS_TXD: CN5.44 ; sheet CPU/TXD1
RxFA-1+: CN2.160(RxFA-1+) ; sheet DP0/RX+
RxFA-1-: CN2.159(RxFA-1-) ; sheet DP0/RX-
RxFA-2+: CN2.154(RxFA-2+) ; sheet DP2/RX+
RxFA-2-: CN2.153(RxFA-2-) ; sheet DP2/RX-
RxFA-3+: CN2.23(RxFA-3+) ; sheet DP1/RX+
RxFA-3-: CN2.24(RxFA-3-) ; sheet DP1/RX-
RxFA-4+: CN2.148(RxFA-4+) ; sheet DP4/RX+
RxFA-4-: CN2.147(RxFA-4-) ; sheet DP4/RX-
RxFA-5+: CN2.32(RxFA-5+) ; sheet DP3/RX+
RxFA-5-: CN2.33(RxFA-5-) ; sheet DP3/RX-
RxFA-6+: CN2.142(RxFA-6+) ; sheet DP6/RX+
RxFA-6-: CN2.141(RxFA-6-) ; sheet DP6/RX-
RxFA-7+: CN2.38(RxFA-7+) ; sheet DP5/RX+
RxFA-7-: CN2.39(RxFA-7-) ; sheet DP5/RX-
RxFA-8+: CN2.136(RxFA-8+) ; sheet DP7/RX+
RxFA-8-: CN2.135(RxFA-8-) ; sheet DP7/RX-
RxFUA+: CN2.14(RxFUA+) IC20.4(/A) R100.2
RxFUA-: CN2.15(RxFUA-) IC20.3(A) R100.1
SMI_RX0: CN6.5
SMI_RX1: CN6.9
SMI_RX2: CN6.15
SMI_RX3: CN6.19
SMI_RX4: CN6.6
SMI_RX5: CN6.10
SMI_RX6: CN6.16
SMI_RX7: CN6.20
SMI_TX0: RP28.4(A)
SMI_TX1: RP28.3(A)
SMI_TX2: RP28.2(A)
SMI_TX3: RP28.1(A)
SMI_TX4: RP29.8(B)
SMI_TX5: RP29.7(B)
SMI_TX6: RP29.6(B)
SMI_TX7: RP29.5(B)
TxFA-1+: CN2.163(TxFA-1+) ; sheet DP0/TX+
TxFA-1-: CN2.162(TxFA-1-) ; sheet DP0/TX-
TxFA-2+: CN2.157(TxFA-2+) ; sheet DP2/TX+
TxFA-2-: CN2.156(TxFA-2-) ; sheet DP2/TX-
TxFA-3+: CN2.20(TxFA-3+) ; sheet DP1/TX+
TxFA-3-: CN2.21(TxFA-3-) ; sheet DP1/TX-
TxFA-4+: CN2.151(TxFA-4+) ; sheet DP4/TX+
TxFA-4-: CN2.150(TxFA-4-) ; sheet DP4/TX-
TxFA-5+: CN2.29(TxFA-5+) ; sheet DP3/TX+
TxFA-5-: CN2.30(TxFA-5-) ; sheet DP3/TX-
TxFA-6+: CN2.145(TxFA-6+) ; sheet DP6/TX+
TxFA-6-: CN2.144(TxFA-6-) ; sheet DP6/TX-
TxFA-7+: CN2.35(TxFA-7+) ; sheet DP5/TX+
TxFA-7-: CN2.36(TxFA-7-) ; sheet DP5/TX-
TxFA-8+: CN2.139(TxFA-8+) ; sheet DP7/TX+
TxFA-8-: CN2.138(TxFA-8-) ; sheet DP7/TX-
TxFUA+: CN2.11(TxFUA+) IC19.4(Q)
TxFUA-: CN2.12(TxFUA-) IC19.3(/Q)
UP0_RD0: CN4.26
UP0_RD1: CN4.28
UP0_RD2: CN4.30
UP0_RD3: CN4.32
UP0_RD4: CN4.34
UP0_RD5: CN4.38
UP0_RD6: CN4.40
UP0_RD7: CN4.42
UP0_RD8: CN4.44
UP0_RD9: CN4.46
UP0_TD0: CN11.15
UP0_TD1: CN11.17
UP0_TD2: CN11.19
UP0_TD3: CN11.21
UP0_TD4: CN11.23
UP0_TD5: CN11.27
UP0_TD6: CN11.29
UP0_TD7: CN11.31
UP0_TD8: CN11.33
UP0_TD9: CN11.35
UP1_RD0: CN4.2
UP1_RD1: CN4.4
UP1_RD2: CN4.6
UP1_RD3: CN4.8
UP1_RD4: CN4.10
UP1_RD5: CN4.14
UP1_RD6: CN4.16
UP1_RD7: CN4.18
UP1_RD8: CN4.20
UP1_RD9: CN4.22
UP1_TD0: CN11.18
UP1_TD1: CN11.20
UP1_TD2: CN11.22
UP1_TD3: CN11.24
UP1_TD4: CN11.26
UP1_TD5: CN11.30
UP1_TD6: CN11.32
UP1_TD7: CN11.34
UP1_TD8: CN11.36
UP1_TD9: CN11.38
UP_ENABLE0: CN11.43 ; sheet FPGA/UP_ENABLE0
UP_ENABLE1: CN11.42 ; sheet FPGA/UP_ENABLE1
UP_LOOPEN0: CN11.47 ; sheet FPGA/UP_LOOPEN0
UP_LOOPEN1: CN11.48 ; sheet FPGA/UP_LOOPEN1
UP_PRBSEN0: CN11.49 ; sheet FPGA/UP_PRBSEN0
UP_PRBSEN1: CN11.41 ; sheet FPGA/UP_PRBSEN1
UP_SFP_DETECT0: CN5.30 ; sheet FPGA/UP_SFP_DETECT0
UP_SFP_DETECT1: CN5.16 ; sheet FPGA/UP_SFP_DETECT1
UP_SFP_LOS0: CN5.28 ; sheet FPGA/UP_SFP_LOS0
UP_SFP_LOS1: CN5.14 ; sheet FPGA/UP_SFP_LOS1
UP_SFP_SCL0: CN5.38 ; sheet FPGA/UP_SFP_SCL0
UP_SFP_SCL1: CN5.24 ; sheet FPGA/UP_SFP_SCL1
UP_SFP_SDA0: CN5.36 ; sheet FPGA/UP_SFP_SDA0
UP_SFP_SDA1: CN5.22 ; sheet FPGA/UP_SFP_SDA1
UP_SFP_TX_DISABLE0: CN5.34 ; sheet FPGA/UP_SFP_TX_DISABLE0
UP_SFP_TX_DISABLE1: CN5.20 ; sheet FPGA/UP_SFP_TX_DISABLE1
UP_SFP_TX_FAULT0: CN5.32 ; sheet FPGA/UP_SFP_TX_FAULT0
UP_SFP_TX_FAULT1: CN5.18 ; sheet FPGA/UP_SFP_TX_FAULT1
UP_SYNC_PASS0: CN11.50 ; sheet FPGA/UP_SYNC_PASS0
UP_SYNC_PASS1: CN11.44 ; sheet FPGA/UP_SYNC_PASS1
UP_SYNCEN0: CN11.45 ; sheet FPGA/UP_SYNCEN0
UP_SYNCEN1: CN11.46 ; sheet FPGA/UP_SYNCEN1
UTCA_ENABLE#: CN2.41(ENABLE#) ; sheet WD/UTCA_ENABLE#
UTCA_GA0: CN2.5(GA0) ; sheet WD/UTCA_GA0
UTCA_GA1: CN2.17(GA1) ; sheet WD/UTCA_GA1
UTCA_GA2: CN2.26(GA2) ; sheet WD/UTCA_GA2
UTCA_PWRON#: CN2.170(PWR_ON) ; sheet WD/UTCA_PWRON#
WD_CS: sheet CPU/SPI1_NPCS0, sheet WD/~{CS}
WD_IN_CLKB: CN4.5 ; sheet WD/WD_IN_CLKB
WD_IN_MAIN: sheet FPGA/WD_OUT, sheet WD/WD_IN_MAIN
WD_IRQ: sheet CPU/EXT_IRQ1, sheet WD/WD_IRQ
WD_MISO: sheet CPU/SPI1_MISO, sheet WD/MISO
WD_MOSI: sheet CPU/SPI1_MOSI, sheet WD/MOSI
WD_OUT: CN4.3 ; sheet FPGA/WD_IN, sheet WD/WD_OUT
WD_SCK: sheet CPU/SPI1_SPCK, sheet WD/SCK
ZBT_CLK: sheet U_MB_ZBT_memory/ZBT_CLK, sheet U_MB_clocking/ZBT_CLK
NetCN2_3: CN2.3(PS1#) D13.1(A)
NetCN2_83: CN2.83(PS0#) D13.2(K)
NetCN3_0a: CN3.0a(case) CN3.0b(case) CN3.0c(case) CN3.0d(case) R118.1
NetCN3_1: CN3.1 ; sheet LETH/TX+
NetCN3_2: CN3.2(TD-) ; sheet LETH/TX-
NetCN3_3: CN3.3 ; sheet LETH/RX+
NetCN3_4: CN3.4 CN3.5 ; sheet LETH/AVDDT
NetCN3_6: CN3.6 ; sheet LETH/RX-
NetCN3_10: CN3.10 ; sheet LETH/LED2
NetCN3_11: CN3.11 ; sheet LETH/LED1
NetCN6_7: CN6.7 RP28.5(B)
NetCN6_8: CN6.8 RP29.1(A)
NetCN6_11: CN6.11 RP28.6(B)
NetCN6_12: CN6.12 RP29.2(A)
NetCN6_17: CN6.17 RP28.7(B)
NetCN6_18: CN6.18 RP29.3(A)
NetCN6_21: CN6.21 RP28.8(B)
NetCN6_22: CN6.22 RP29.4(A)
NetD1_1: D1.1(A) RP5.1(A)
NetD2_1: D2.1(A) RP5.2(A)
NetD3_1: D3.1(A) RP5.3(A)
NetD4_1: D4.1(A) RP5.4(A)
NetD5_KG: D5.KG RP6.1(A)
NetD5_KR: D5.KR RP6.2(A)
NetD6_KG: D6.KG RP6.3(A)
NetD6_KR: D6.KR RP6.4(A)
NetD7_KG: D7.KG RP7.1(A)
NetD7_KR: D7.KR RP7.2(A)
NetD8_KG: D8.KG RP7.3(A)
NetD8_KR: D8.KR RP7.4(A)
NetD9_KG: D9.KG RP8.1(A)
NetD9_KR: D9.KR RP8.2(A)
NetD10_KG: D10.KG RP8.3(A)
NetD10_KR: D10.KR RP8.4(A)
NetD11_KG: D11.KG RP9.1(A)
NetD11_KR: D11.KR RP9.2(A)
NetD12_KG: D12.KG RP9.3(A)
NetD12_KR: D12.KR RP9.4(A)
NetR68_1: R68.1 ; sheet U_MB_fpga_power/JTAG_TDO
NetR69_2: R69.2 ; sheet CPU/TK0
NetR70_2: R70.2 ; sheet CPU/TK1
NetR71_2: R71.2 ; sheet CPU/TD0
NetR72_2: R72.2 ; sheet CPU/TD1
NetR73_2: R73.2 ; sheet CPU/PCK0
NetR74_1: R74.1 ; sheet CPU/SPI0_SPCK
NetR74_2: R74.2 ; sheet U_MB_CPU_memory/SPI_SCK
NetR111_2: R111.2 R112.1
NetR113_2: R113.2 R114.1
NetR115_2: R115.2 R116.1
(unnamed): sheet LETH/TXD0, sheet CPU/E_TX0
(unnamed): sheet LETH/TXD1, sheet CPU/E_TX1
(unnamed): sheet LETH/TX_EN, sheet CPU/E_TXEN
(unnamed): sheet LETH/RXD1, sheet CPU/E_RX1
(unnamed): sheet LETH/RXD0, sheet CPU/E_RX0
(unnamed): sheet LETH/RX_DV, sheet CPU/E_RXDV
(unnamed): sheet LETH/RX_ER, sheet CPU/E_RXER
(unnamed): sheet LETH/MDC, sheet CPU/E_MDC
(unnamed): sheet LETH/MDIO, sheet CPU/E_MDIO
(unnamed): sheet LETH/MDINTR, sheet CPU/E_MDINTR
(unnamed): sheet LETH/TX_CLK, sheet CPU/E_TXCK
(unnamed): sheet CPU/EXT_IRQ0, sheet FPGA/CPU_IRQ0
(unnamed): sheet CPU/EXT_DMARQ1, sheet FPGA/CPU_DMARQ
(unnamed): sheet CPU/EXT_FIQ_DMARQ2, sheet FPGA/CPU_IRQ1
(unnamed): sheet CPU/EBI1_NWAIT, sheet FPGA/CPU_NWAIT
(unnamed): sheet CPU/EBI0_NBS1, sheet U_MB_CPU_memory/NBS1
(unnamed): sheet CPU/EBI0_NBS3, sheet U_MB_CPU_memory/NBS3
(unnamed): sheet CPU/EBI0_SDCS, sheet U_MB_CPU_memory/SDCS
(unnamed): sheet CPU/EBI0_SDCK, sheet U_MB_CPU_memory/SDCLK
(unnamed): sheet CPU/EBI0_SDCKE, sheet U_MB_CPU_memory/SDCKE
(unnamed): sheet CPU/EBI0_SDA10, sheet U_MB_CPU_memory/SDA10
(unnamed): sheet CPU/EBI0_SDWE, sheet U_MB_CPU_memory/SDWE
(unnamed): sheet CPU/EBI0_CAS, sheet U_MB_CPU_memory/CAS
(unnamed): sheet CPU/EBI0_RAS, sheet U_MB_CPU_memory/RAS
(unnamed): sheet CPU/EBI1_NCS0, sheet FPGA/CPU_CS
(unnamed): sheet CPU/EBI1_NRD, sheet FPGA/CPU_RD
(unnamed): sheet CPU/EBI1_NWE, sheet FPGA/CPU_WR
(unnamed): sheet CPU/EBI1_NBS1, sheet FPGA/CPU_NBS1
(unnamed): sheet CPU/NAND_CS, sheet U_MB_CPU_memory/NAND_CS
(unnamed): sheet CPU/EBI0_NANDOE, sheet U_MB_CPU_memory/NAND_OE
(unnamed): sheet CPU/EBI0_NANDWE, sheet U_MB_CPU_memory/NAND_WE
(unnamed): sheet CPU/SPI0_NPCS0, sheet U_MB_CPU_memory/SPI_CS
(unnamed): sheet CPU/SPI0_MISO, sheet U_MB_CPU_memory/SPI_SO
(unnamed): sheet CPU/SPI0_MOSI, sheet U_MB_CPU_memory/SPI_SI
(unnamed): sheet FPGA/ZBT_LBO, sheet U_MB_ZBT_memory/LBO
(unnamed): sheet FPGA/ZBT_RW, sheet U_MB_ZBT_memory/RW
(unnamed): sheet FPGA/ZBT_CEN, sheet U_MB_ZBT_memory/CEN
(unnamed): sheet FPGA/ZBT_ADV/LD, sheet U_MB_ZBT_memory/ADV/LD
(unnamed): sheet FPGA/ZBT_OE, sheet U_MB_ZBT_memory/OE
(unnamed): sheet WD/SENSOR_SCL, sheet SENS/SENSOR_SCL
(unnamed): sheet WD/SENSOR_SDA, sheet SENS/SENSOR_SDA

Not connected (* = marked no-connect by the designer): CN2 6(RSVD) 8(RSVD) 44(TxFA-9+)* 45(TxFA-9-)* 47(RxFA-9+) 48(RxFA-9-) 50(TxFA-10+)* 51(TxFA-10-)* 53(RxFA-10+) 54(RxFA-10-) 59(TxFA-11+)* 60(TxFA-11-)* 62(RxFA-11+) 63(RxFA-11-) 65(TxFA-12+)* 66(TxFA-12-)* 68(RxFA-12+) 69(RxFA-12-) 74(XOVER0+)* 75(XOVER0-)* 77(XOVER1+) 78(XOVER1-) 80(XOVER2+) 81(XOVER2-) 87(IPMBL-SDA-12) 88(IPMBL-SCL-12) 90(IPMBL-SDA-11) 91(IPMBL-SCL-11) 93(IPMBL-SDA-10) 94(IPMBL-SCL-10) 96(IPMBL-SDA-9) 97(IPMBL-SCL-9) 132(RSVD) 133(TMREQ#)* 165(TCK)* 166(TMS)* 167(TRST#)* 168(TDO)* 169(TDI)*; CN3 7; CN6 25 26 27 28

## Buses and harness runs
bus AUX[0..7] = sheet FPGA/AUX[0..7]
bus CMI_PIO[0..3]
bus CMI_PIO[0..3] = sheet FPGA/CMI_PIO[0..3]
bus CPU_A[0..20] = EBI1_A[0..22] = sheet CPU/EBI1_A[0..22] = sheet FPGA/CPU_A[0..20]
bus CPU_D[0..31] = EBI1_D[0..31] = sheet CPU/EBI1_D[0..31] = sheet FPGA/CPU_D[0..31]
bus DP0_RD[0..9] = sheet DP0/RD[0..9]
bus DP0_RD[0..9] = sheet FPGA/DP0_RD[0..9]
bus DP0_TD[0..9] = sheet DP0/TD[0..9]
bus DP0_TD[0..9] = sheet FPGA/DP0_TD[0..9]
bus DP1_RD[0..9] = sheet DP1/RD[0..9]
bus DP1_RD[0..9] = sheet FPGA/DP1_RD[0..9]
bus DP1_TD[0..9] = sheet DP1/TD[0..9]
bus DP1_TD[0..9] = sheet FPGA/DP1_TD[0..9]
bus DP2_RD[0..9] = sheet DP2/RD[0..9]
bus DP2_RD[0..9] = sheet FPGA/DP2_RD[0..9]
bus DP2_TD[0..9] = sheet DP2/TD[0..9]
bus DP2_TD[0..9] = sheet FPGA/DP2_TD[0..9]
bus DP3_RD[0..9] = sheet DP3/RD[0..9]
bus DP3_RD[0..9] = sheet FPGA/DP3_RD[0..9]
bus DP3_TD[0..9] = sheet DP3/TD[0..9]
bus DP3_TD[0..9] = sheet FPGA/DP3_TD[0..9]
bus DP4_RD[0..9] = sheet DP4/RD[0..9]
bus DP4_RD[0..9] = sheet FPGA/DP4_RD[0..9]
bus DP4_TD[0..9] = sheet DP4/TD[0..9]
bus DP4_TD[0..9] = sheet FPGA/DP4_TD[0..9]
bus DP5_RD[0..9] = sheet DP5/RD[0..9]
bus DP5_RD[0..9] = sheet FPGA/DP5_RD[0..9]
bus DP5_TD[0..9] = sheet DP5/TD[0..9]
bus DP5_TD[0..9] = sheet FPGA/DP5_TD[0..9]
bus DP6_RD[0..9] = sheet DP6/RD[0..9]
bus DP6_RD[0..9] = sheet FPGA/DP6_RD[0..9]
bus DP6_TD[0..9] = sheet DP6/TD[0..9]
bus DP6_TD[0..9] = sheet FPGA/DP6_TD[0..9]
bus DP7_RD[0..9] = sheet DP7/RD[0..9]
bus DP7_RD[0..9] = sheet FPGA/DP7_RD[0..9]
bus DP7_TD[0..9] = sheet DP7/TD[0..9]
bus DP7_TD[0..9] = sheet FPGA/DP7_TD[0..9]
bus DP_ENABLE[0..7] = sheet FPGA/DP_ENABLE[0..7]
bus DP_LOOPEN[0..7] = sheet FPGA/DP_LOOPEN[0..7]
bus DP_PRBSEN[0..7] = sheet FPGA/DP_PRBSEN[0..7]
bus DP_SYNC_PASS[0..7] = sheet FPGA/DP_SYNC_PASS[0..7]
bus DP_SYNCEN[0..7] = sheet FPGA/DP_SYNCEN[0..7]
bus EBI0_A[0..22] = sheet CPU/EBI0_A[0..22] = sheet U_MB_CPU_memory/A[0..22]
bus EBI0_D[0..31] = sheet CPU/EBI0_D[0..31] = sheet U_MB_CPU_memory/D[0..31]
bus GPIO[0..7]
bus GPIO[0..7] = sheet FPGA/GPIO[0..7]
bus PB[16..31] = sheet CPU/PB[16..31]
bus PC[0..19] = sheet CPU/PC[0..19]
bus PE[0..19] = sheet CPU/PE[0..19]
bus RBCLK_DP[0..7] = sheet FPGA/RBCLK_DP[0..7]
bus SMI_RX[0..7]
bus SMI_RX[0..7] = sheet FPGA/SMI_RX[0..7]
bus SMI_TX[0..7]
bus SMI_TX[0..7] = sheet FPGA/SMI_TX[0..7]
bus UP0_RD[0..9]
bus UP0_RD[0..9] = sheet FPGA/UP0_RD[0..9]
bus UP0_TD[0..9]
bus UP0_TD[0..9] = sheet FPGA/UP0_TD[0..9]
bus UP1_RD[0..9]
bus UP1_RD[0..9] = sheet FPGA/UP1_RD[0..9]
bus UP1_TD[0..9]
bus UP1_TD[0..9] = sheet FPGA/UP1_TD[0..9]
bus ZBT_A[0..16] = sheet FPGA/ZBT_A[0..16] = sheet U_MB_ZBT_memory/ZBT_A[0..16]
bus ZBT_BW[1..4] = sheet FPGA/ZBT_BW[1..4] = sheet U_MB_ZBT_memory/ZBT_BW[1..4]
bus ZBT_IO[0..31] = sheet FPGA/ZBT_IO[0..31] = sheet U_MB_ZBT_memory/ZBT_IO[0..31]
bus ZBT_IOP[1..4] = sheet FPGA/ZBT_IOP[1..4] = sheet U_MB_ZBT_memory/ZBT_IOP[1..4]

## Notes on the sheet
- ESD strip
- Front Panel
- IO
- (near RP5) uTCA standard LEDs
- !
- CPU general purpose LEDs
- MAIN FPGA
- MAIN CPU
- Main System Diagram with:
  - big Cyclone3-120 FPGA
  - AT91SAM9263 CPU + memories + peripherals
  - downlink PHYs and uTCA backplane interface
  Includes all front panel controls/connectors being placed on MCH PCB1 and most important connectors (backplane, mezzanines, JTAGs)
- Downlink PHYs
- SMI I/F
- UARTs
- Various signals
- (near RP7) FPGA general purpose LEDs
- Downlink ports
- CMI I/F
- Memory interface (EBI0)
- GPIO
- Clocks
- External 100 Base-T port
- RMII Ethernet I/F
- CPU I/F
- WD I/F
- Uplink ports
- FPGA I/F
- ZBT mem I/F
- uTCA hotswap switch
- Watchdog MCU
- Watchdog IO
- FPGA JTAG port
- Sensor/EEPROM
- UTCA backplane IPMI/management
- Resistor mounting depends on JTAG configuration:
  - external JTAG connector (FPGA JTAG) - left resistors mounted
  - CPU-driven JTAG - right resistors mounted
- CPU DBGU port
- White Rabbit Switch MCH - mainboard
- System diagram & connectors
- (in symbol ETH_J0011D21BNL) right; left; J1; CHS; J2; TD+; J6; CT; J4; J5; nc; J3; RD-; J7; J8; RD+
- (in symbol R0402_0R_JUMPER) 1%
- (in symbol R0402_10K_1%_0.0625W_100PPM) 1%
- (in symbol R0402_22R_1%_0.0625W_100PPM) 1%
- (in symbol R0402_33R_1%_0.0625W_100PPM) 1%
- (in symbol R0402_100R_1%_0.0625W_100PPM) 1%
- (in symbol R1206_0R_JUMPER) 1%
- (in symbol R1206_100K_1%_0.25W_100PPM) 1%

## Library data of the parts
C194 C195 = CC0402_100NF_16V_10%_X7R: Non-polarised capacitor; Part Description: SMD Multilayer Chip Ceramic Capacitor; Manufacturer: GENERIC; Manufacturer1 Part Number: 223878715649; Manufacturer1 Datasheet: \\cern.ch\dfs\Applications\Altium\Datasheets\CC0402_X7R_PHYCOMP.pdf; Value: 100nF; Voltage: 16V; TC: X7R; Tolerance: ±10%; Table: Capacitors SMD; Part Number: CC0402_100NF_16V_10%_X7R; Component Kind: Standard; Component Type: Standard; Designator: Capacitor - non polarized; Library Reference: Capacitor - non polarized; Pin Count: 2; Status: Not Recommended; Manufacturer Part Number: CC0402_100NF_16V_10%_X7R; Case: 0402; Mounted: Yes; Socket: No; SMD: Yes; Manufacturer1 Example: PHYCOMP; Manufacturer1 ComponentHeight: 0.55mm; HelpURL: \\cern.ch\dfs\Applications\Altium\Datasheets\CC0402_X7R_PHYCOMP.pdf; Author: CERN DEM JLC; CreateDate: 12/3/2007; LatestRevisionDate: 12/3/2007
CN2 = UTCA_MCH_TONGUE1: microTCA MTCA.0 standard MCH connector 1; Value: MCH tongue 1
CN3 = ETH_J0011D21BNL: RJ45 with magnetics and LEDs (Kamami, Kristech,Mouser); Supplier: Mouser
CN4 CN5 CN11 = KX15_50p: multipin B2B connector (plug); Supplier: Farnell
CN6 = KX15_30p: multipin B2B connector (plug); Supplier: Mouser
CN7 CN8 = CONN_2x5 1.27: 1.27 mm dual row goldpin; RefId: PBHTD10SPP; Value: PBHTD10SPP; Supplier: Maritex
D1-D4 = LED0: Chip LED (any color); Published: 8-Jun-2000; LatestRevisionDate: 08-Jul-2005; LatestRevisionNote: Mech Layer 1 removed.; PackageReference: LED-0; Publisher: Altium Limited
D5-D12 = LED_2_colour: pin to pad: A>3 KG>1 KR>2; RefId: P593DKR-ND; Value: LNJ123W8PRZ; Supplier: Digikey
D13 = D Schottky: Schottky Diode; Published: 8-Jun-2000; LatestRevisionDate: 17-Jul-2002; LatestRevisionNote: Re-released for DXP Platform.; PackageReference: SMB; Publisher: Altium Limited; Code_JEDEC: DO-214-AA
IC19 = SN65LVDS1: TTL->LVDS buffer; RefId: 8452482; Value: SN65LVDS1DBVT; Supplier: Farnell
IC20 = SN65LVDS2: LVDS->TTL buffer; RefId: 1652269; Value: SN65LVDS2DBVR; Supplier: Farnell
R68-R73 = R0402_22R_1%_0.0625W_100PPM: Resistor - 1%; Part Description: General Purpose Thick Film Chip Resistor; Manufacturer: GENERIC; Manufacturer1 Part Number: 232270672209; Manufacturer1 Datasheet: \\cern.ch\dfs\Applications\Altium\Datasheets\R0402_Phycomp_RC0402.pdf; TC: ±100ppm/°C; Table: Resistors SMD; Part Number: R0402_22R_1%_0.0625W_100PPM; Component Kind: Standard; Component Type: Standard; Designator: Resistor - 1%; Library Reference: Resistor - 1%; Pin Count: 2; Value: 22; Status: Not recommended; Power: 0.0625W; Tolerance: ±1%; Manufacturer Part Number: R0402_22R_1%_0.0625W_100PPM; Case: 0402; Mounted: Yes; Socket: No; SMD: Yes; Manufacturer1 Example: PHYCOMP; Manufacturer1 ComponentHeight: 0.4mm; HelpURL: \\cern.ch\dfs\Applications\Altium\Datasheets\R0402_Phycomp_RC0402.pdf; Author: CERN DEM JLC; CreateDate: 12/3/2007; LatestRevisionDate: 3/13/2008
R74 = R0402_33R_1%_0.0625W_100PPM: Resistor - 1%; Part Description: General Purpose Thick Film Chip Resistor; Manufacturer: GENERIC; Manufacturer1 Part Number: 232270673309; Manufacturer1 Datasheet: \\cern.ch\dfs\Applications\Altium\Datasheets\R0402_Phycomp_RC0402.pdf; TC: ±100ppm/°C; Table: Resistors SMD; Part Number: R0402_33R_1%_0.0625W_100PPM; Component Kind: Standard; Component Type: Standard; Designator: Resistor - 1%; Library Reference: Resistor - 1%; Pin Count: 2; Value: 33; Status: Not recommended; Power: 0.0625W; Tolerance: ±1%; Manufacturer Part Number: R0402_33R_1%_0.0625W_100PPM; Case: 0402; Mounted: Yes; Socket: No; SMD: Yes; Manufacturer1 Example: PHYCOMP; Manufacturer1 ComponentHeight: 0.4mm; HelpURL: \\cern.ch\dfs\Applications\Altium\Datasheets\R0402_Phycomp_RC0402.pdf; Author: CERN DEM JLC; CreateDate: 12/3/2007; LatestRevisionDate: 3/13/2008
R75 R79 R82 R102 R109 R110 = R0402_10K_1%_0.0625W_100PPM: Resistor - 1%; Part Description: General Purpose Thick Film Chip Resistor; Manufacturer: GENERIC; Manufacturer1 Part Number: 232270671003; Manufacturer1 Datasheet: \\cern.ch\dfs\Applications\Altium\Datasheets\R0402_Phycomp_RC0402.pdf; TC: ±100ppm/°C; Table: Resistors SMD; Part Number: R0402_10K_1%_0.0625W_100PPM; Component Kind: Standard; Component Type: Standard; Designator: Resistor - 1%; Library Reference: Resistor - 1%; Pin Count: 2; Value: 10k; Status: Not recommended; Power: 0.0625W; Tolerance: ±1%; Manufacturer Part Number: R0402_10K_1%_0.0625W_100PPM; Case: 0402; Mounted: Yes; Socket: No; SMD: Yes; Manufacturer1 Example: PHYCOMP; Manufacturer1 ComponentHeight: 0.4mm; HelpURL: \\cern.ch\dfs\Applications\Altium\Datasheets\R0402_Phycomp_RC0402.pdf; Author: CERN DEM JLC; CreateDate: 12/3/2007; LatestRevisionDate: 3/13/2008
R76-R78 R80 R81 R83 R95 R99 = R0402_0R_JUMPER: Resistor - 1%; Part Description: 1A (0.05R Max DC Resistance) Zero Ohm Jumper; Manufacturer: GENERIC; Manufacturer1 Part Number: 232270591001; Manufacturer1 Datasheet: \\cern.ch\dfs\Applications\Altium\Datasheets\R0402_Phycomp_RC0402.pdf; Value: 0; Table: Resistors SMD; Part Number: R0402_0R_JUMPER; Component Kind: Standard; Component Type: Standard; Designator: Resistor - 1%; Library Reference: Resistor - 1%; Pin Count: 2; Status: Not recommended; Manufacturer Part Number: R0402_0R_JUMPER; Case: 0402; Mounted: Yes; Socket: No; SMD: Yes; Manufacturer1 Example: PHYCOMP; Manufacturer1 ComponentHeight: 0.4mm; HelpURL: \\cern.ch\dfs\Applications\Altium\Datasheets\R0402_Phycomp_RC0402.pdf; Author: CERN DEM JLC; CreateDate: 12/3/2007; LatestRevisionDate: 3/13/2008
R100 = R0402_100R_1%_0.0625W_100PPM: Resistor - 1%; Part Description: General Purpose Thick Film Chip Resistor; Manufacturer: GENERIC; Manufacturer1 Part Number: 232270671001; Manufacturer1 Datasheet: \\cern.ch\dfs\Applications\Altium\Datasheets\R0402_Phycomp_RC0402.pdf; TC: ±100ppm/°C; Table: Resistors SMD; Part Number: R0402_100R_1%_0.0625W_100PPM; Component Kind: Standard; Component Type: Standard; Designator: Resistor - 1%; Library Reference: Resistor - 1%; Pin Count: 2; Value: 100; Status: Not recommended; Power: 0.0625W; Tolerance: ±1%; Manufacturer Part Number: R0402_100R_1%_0.0625W_100PPM; Case: 0402; Mounted: Yes; Socket: No; SMD: Yes; Manufacturer1 Example: PHYCOMP; Manufacturer1 ComponentHeight: 0.4mm; HelpURL: \\cern.ch\dfs\Applications\Altium\Datasheets\R0402_Phycomp_RC0402.pdf; Author: CERN DEM JLC; CreateDate: 12/3/2007; LatestRevisionDate: 3/13/2008
R111-R116 = R1206_100K_1%_0.25W_100PPM: Resistor - 1%; Part Description: General Purpose Thick Film Chip Resistor; Manufacturer: GENERIC; Manufacturer1 Part Number: NRC12F1003TRF; Manufacturer1 Datasheet: \\cern.ch\dfs\Applications\Altium\Datasheets\R1206_NIC_NRC.pdf; Power: 0.25W; TC: ±100ppm/°C; Table: Resistors SMD; Part Number: R1206_100K_1%_0.25W_100PPM; Component Kind: Standard; Component Type: Standard; Designator: Resistor - 1%; Library Reference: Resistor - 1%; Pin Count: 2; Value: 100k; Status: Preferred; Tolerance: ±1%; Manufacturer Part Number: R1206_100K_1%_0.25W_100PPM; Case: 1206; Mounted: Yes; Socket: No; SMD: Yes; Manufacturer1 Example: NIC COMPONENT; Manufacturer1 ComponentHeight: 0.65mm; HelpURL: \\cern.ch\dfs\Applications\Altium\Datasheets\R1206_NIC_NRC.pdf; Author: CERN DEM JLC; CreateDate: 2007-12-03; LatestRevisionDate: 2008-03-13
R118 = R1206_0R_JUMPER: Resistor - 1%; Part Description: 2A (0.05R Max DC Resistance) Zero Ohm Jumper; Manufacturer: GENERIC; Manufacturer1 Part Number: NRC12Z0; Manufacturer1 Datasheet: \\cern.ch\dfs\Applications\Altium\Datasheets\R1206_NIC_NRC.pdf; Table: Resistors SMD; Part Number: R1206_0R_JUMPER; Component Kind: Standard; Component Type: Standard; Designator: Resistor - 1%; Library Reference: Resistor - 1%; Pin Count: 2; Value: 0; Status: Preferred; Manufacturer Part Number: R1206_0R_JUMPER; Case: 1206; Mounted: Yes; Socket: No; SMD: Yes; Manufacturer1 Example: NIC COMPONENT; Manufacturer1 ComponentHeight: 0.65mm; HelpURL: \\cern.ch\dfs\Applications\Altium\Datasheets\R1206_NIC_NRC.pdf; Author: CERN DEM JLC; CreateDate: 2007-12-03; LatestRevisionDate: 2008-03-13
RP5-RP9 = Res_Pack4_220R_YC124_1: 4-resistor pack; RefId: AVX  CRB2A4 series; Supplier: Farnell
RP28 RP29 = Res_Pack4_22R_YC124: 4-resistor pack; RefId: AVX  CRB2A4 series; Supplier: Farnell
S1 = uTCA_HOTSWAP_SWITCH: Push button; RefId: 20849-209; Value: uTCA hotswap switch; Supplier: Schroff